# Altium schematic sheet transc_MIWI434.SchDoc
size A
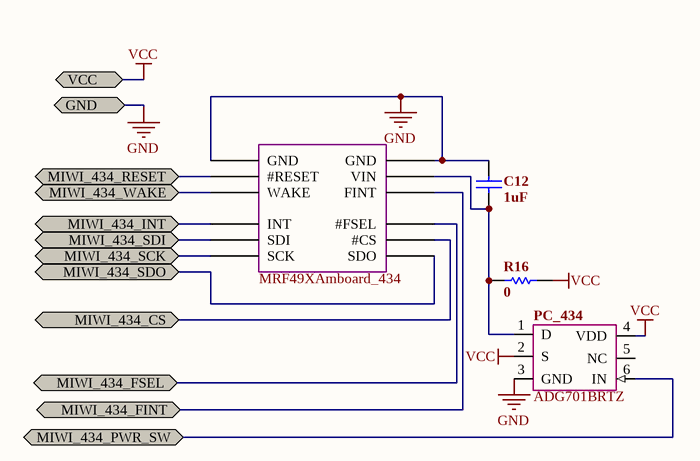
[diagram p0: transc_MIWI434.SchDoc]

## Parts
C12  value 1uF  [1608[0603]]  (hidden comment: Cap)
MRF49XAmboard_434  MRF49XAmboard  [MRF49XAmboard]  (value not drawn)
PC_434  ADG701BRTZ  [SOT23-6_L]
R16  value 0  [1608[0603]]  (hidden comment: resistor)

## Ports
GND, MIWI_434_CS, MIWI_434_FINT, MIWI_434_FSEL, MIWI_434_INT, MIWI_434_PWR_SW, MIWI_434_RESET, MIWI_434_SCK, MIWI_434_SDI, MIWI_434_SDO, MIWI_434_WAKE, VCC

## Nets
GND: C12.1 MRF49XAmboard_434.1(GND) MRF49XAmboard_434.12(GND) PC_434.3(GND) ; port GND
VCC: PC_434.2(S) PC_434.4(VDD) R16.1 ; port VCC
MIWI_434_CS: MRF49XAmboard_434.8(#CS) ; port MIWI_434_CS
MIWI_434_FINT: MRF49XAmboard_434.10(FINT) ; port MIWI_434_FINT
MIWI_434_FSEL: MRF49XAmboard_434.9(#FSEL) ; port MIWI_434_FSEL
MIWI_434_INT: MRF49XAmboard_434.4(INT) ; port MIWI_434_INT
MIWI_434_PWR_SW: PC_434.6(IN) ; port MIWI_434_PWR_SW
MIWI_434_RESET: MRF49XAmboard_434.2(#RESET) ; port MIWI_434_RESET
MIWI_434_SCK: MRF49XAmboard_434.6(SCK) ; port MIWI_434_SCK
MIWI_434_SDI: MRF49XAmboard_434.5(SDI) ; port MIWI_434_SDI
MIWI_434_SDO: MRF49XAmboard_434.7(SDO) ; port MIWI_434_SDO
MIWI_434_WAKE: MRF49XAmboard_434.3(WAKE) ; port MIWI_434_WAKE
NetC12_2: C12.2 MRF49XAmboard_434.11(VIN) PC_434.1(D) R16.2

Not connected (* = marked no-connect by the designer): PC_434 5(NC)

## Library data of the parts
C12 = Cap: Capacitor
MRF49XAmboard_434 = MRF49XAmboard: Microchip RF radio; buy: farnell:1630202
R16 = RES